# Altium schematic sheet USB C Port.SchDoc
size A; SheetNumber: 5; SheetTotal: 9
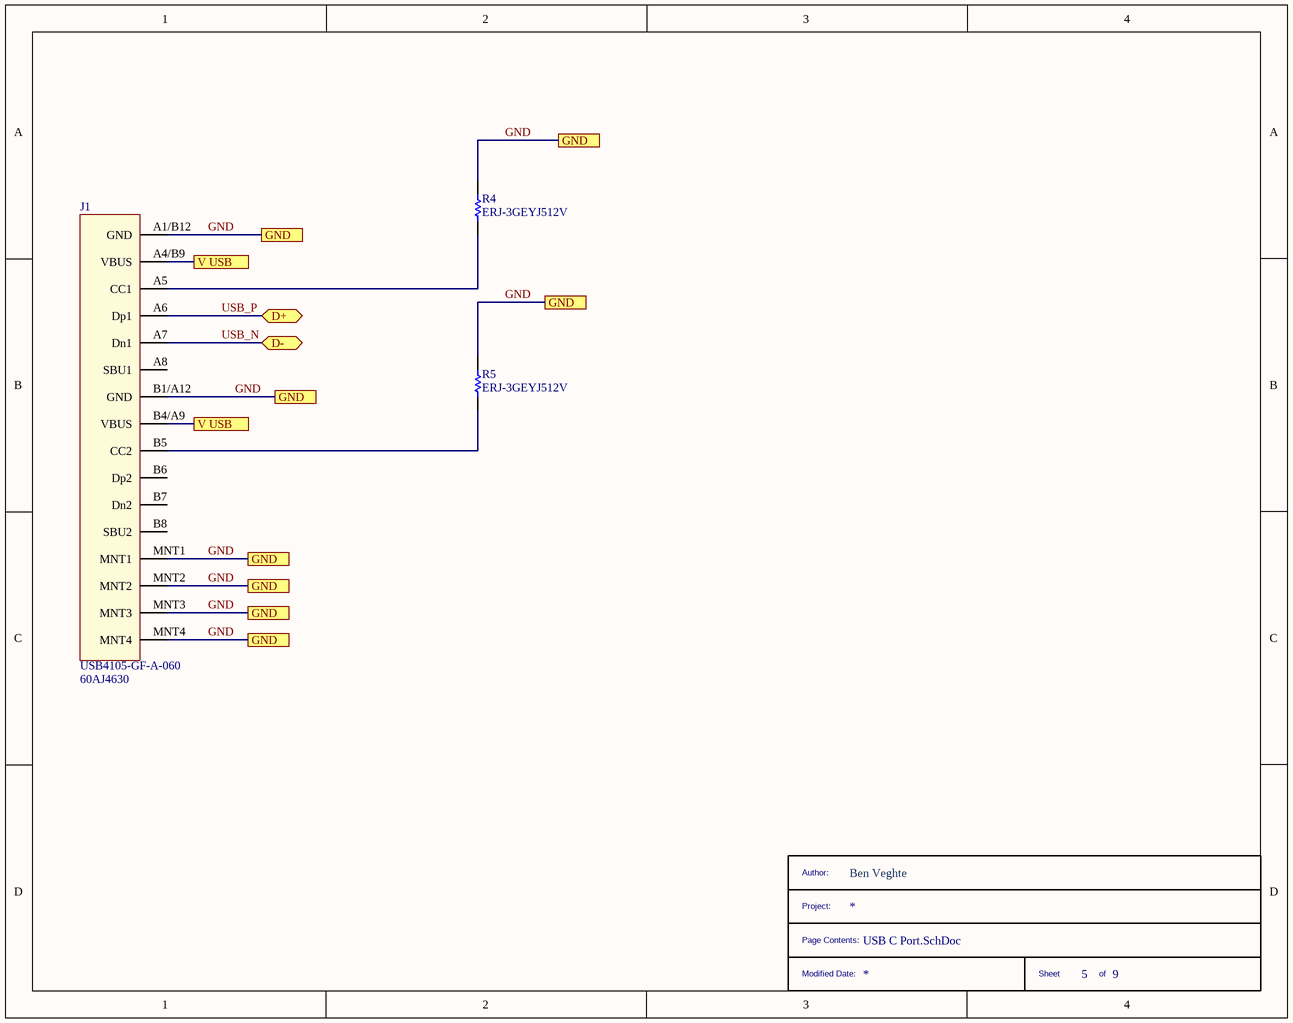
[diagram p0: USB C Port.SchDoc]

## Parts
*  __TITLE_BLOCK__  (value not drawn)  (graphical)
J1  USB4105-GF-A-060  Supplier Part Number 1: 60AJ4630  [USB4105-GF-A-120]
R4  ERJ-3GEYJ512V  [RESC1608X55X30LL15T15]
R5  ERJ-3GEYJ512V  [RESC1608X55X30LL15T15]

## Ports
D+ (bidir), D- (bidir), GND, V USB

## Nets
GND: J1.A1/B12(GND) J1.B1/A12(GND) J1.MNT1 J1.MNT2 J1.MNT3 J1.MNT4 R4.2 R5.2 ; port GND
USB_N: J1.A7(Dn1) ; port D-
USB_P: J1.A6(Dp1) ; port D+
V USB: J1.A4/B9(VBUS) J1.B4/A9(VBUS) ; port V USB
NetJ1_A5: J1.A5(CC1) R4.1
NetJ1_B5: J1.B5(CC2) R5.1

Not connected (* = marked no-connect by the designer): J1 A8(SBU1) B6(Dp2) B7(Dn2) B8(SBU2)

## Notes on the sheet
- (in symbol __TITLE_BLOCK__) Author:; Ben Veghte; Project:; Page Contents:; Modified Date:; Sheet; of

## Library data of the parts
J1 = USB4105-GF-A-060: USB CONN, 2.0 TYPE C, RCPT, 16POS, SMT; USB Connector Type: USB Type C; USB Standard: USB 2.0; Gender: Receptacle;...; Manufacturer: Global Connector Technology; Supplier 1: Newark; Manufacturer Part Number: USB4105-GF-A-060; RoHS: Yes; Category: Connectors; Stock 1: 1600; Pricing 1: 1=0.93700, 100=0.74000, 250=0.67600, 500=0.61600, 800=0.61600, 1000=0.57400 (USD)
R4 R5 = CMP-2000-00803-1: Manufacturer: Panasonic; Part Number: ERJ-3GEYJ512V